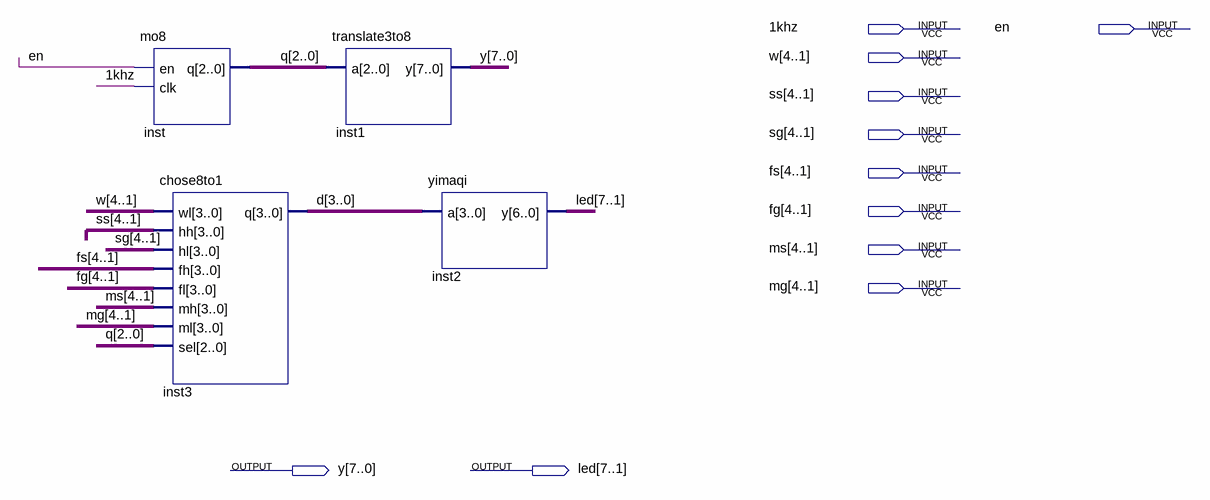
[diagram p0: schematic sheet]
// Quartus schematic xianshi.bdf as structural Verilog: 4 symbols, 11 pins
module xianshi (
  input  \1khz ,
  input  en,
  input  [4:1] w,
  input  [4:1] ss,
  input  [4:1] sg,
  input  [4:1] fs,
  input  [4:1] fg,
  input  [4:1] ms,
  input  [4:1] mg,
  output [7:0] y,
  output [7:1] led
);

  wire [2:0] q;
  wire [3:0] d;

  mo8 inst (.en(en), .clk(\1khz ), .q(q));
  chose8to1 inst3 (.wl(w), .hh(ss), .hl(sg), .fh(fs), .fl(fg), .mh(ms), .ml(mg), .sel(q), .q(d));
  translate3to8 inst1 (.a(q), .y(y));
  yimaqi inst2 (.a(d), .y(led));
endmodule
